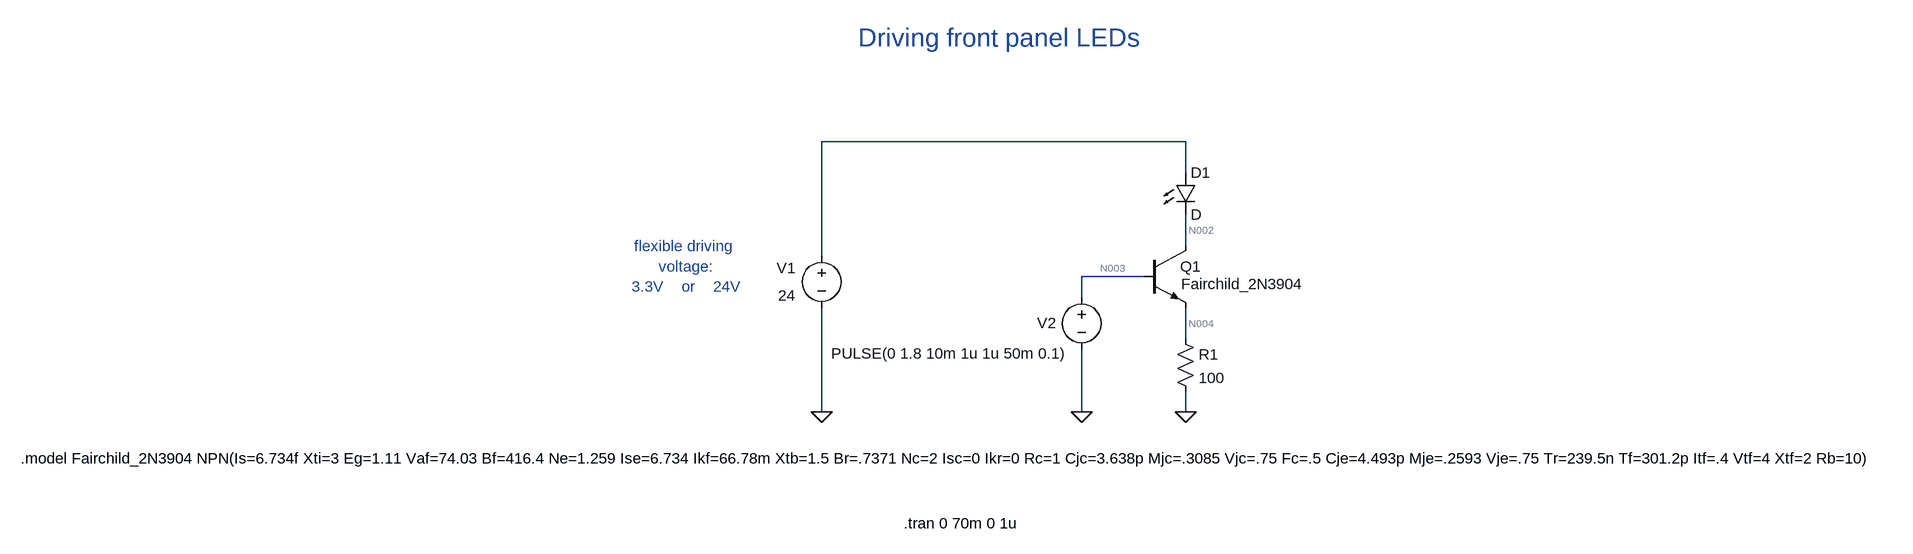
[diagram p0: schematic UZ_CB_LEDdrive.asc]
UZ_CB_LEDdrive.asc, the LTspice schematic file:
Version 4
SHEET 1 3568 680
WIRE 448 0 -112 0
WIRE 448 48 448 0
WIRE 448 160 448 112
WIRE -112 176 -112 0
WIRE 384 208 288 208
WIRE 288 240 288 208
WIRE 448 304 448 256
WIRE -112 416 -112 256
WIRE 288 416 288 320
WIRE 448 416 448 384
FLAG -112 416 0
FLAG 448 416 0
FLAG 288 416 0
SYMBOL voltage -112 160 R0
WINDOW 0 -69 35 Left 2
WINDOW 3 -67 77 Left 2
WINDOW 123 0 0 Left 2
WINDOW 39 0 0 Left 2
SYMATTR InstName V1
SYMATTR Value 24
SYMBOL res 432 288 R0
SYMATTR InstName R1
SYMATTR Value 100
SYMBOL LED 432 48 R0
SYMATTR InstName D1
SYMBOL voltage 288 224 R0
WINDOW 0 -68 55 Left 2
WINDOW 3 -385 102 Left 2
WINDOW 123 0 0 Left 2
WINDOW 39 0 0 Left 2
SYMATTR InstName V2
SYMATTR Value PULSE(0 1.8 10m 1u 1u 50m 0.1)
SYMBOL npn 384 160 R0
WINDOW 3 57 59 Left 2
SYMATTR InstName Q1
SYMATTR Value Fairchild_2N3904
TEXT -1344 488 Left 2 !.model Fairchild_2N3904 NPN(Is=6.734f Xti=3 Eg=1.11 Vaf=74.03 Bf=416.4 Ne=1.259 Ise=6.734 Ikf=66.78m Xtb=1.5 Br=.7371 Nc=2 Isc=0 Ikr=0 Rc=1 Cjc=3.638p Mjc=.3085 Vjc=.75 Fc=.5 Cje=4.493p Mje=.2593 Vje=.75 Tr=239.5n Tf=301.2p Itf=.4 Vtf=4 Xtf=2 Rb=10)
TEXT 14 588 Left 2 !.tran 0 70m 0 1u
TEXT -56 -160 Left 4 ;Driving front panel LEDs
TEXT -320 192 Center 2 ;flexible driving \nvoltage:\n3.3V    or    24V

The netlist it stands for:
* UZ_CB_LEDdrive.asc
V1 N001 0 24
R1 N004 0 100
D1 N001 N002 D
V2 N003 0 PULSE(0 1.8 10m 1u 1u 50m 0.1)
Q1 N002 N003 N004 0 Fairchild_2N3904
.model D D
.lib standard.dio
.model NPN NPN
.model PNP PNP
.lib standard.bjt
.model Fairchild_2N3904 NPN(Is=6.734f Xti=3 Eg=1.11 Vaf=74.03 Bf=416.4 Ne=1.259 Ise=6.734 Ikf=66.78m Xtb=1.5 Br=.7371 Nc=2 Isc=0 Ikr=0 Rc=1 Cjc=3.638p Mjc=.3085 Vjc=.75 Fc=.5 Cje=4.493p Mje=.2593 Vje=.75 Tr=239.5n Tf=301.2p Itf=.4 Vtf=4 Xtf=2 Rb=10)
.tran 0 70m 0 1u
* Driving front panel LEDs
* flexible driving
* voltage:
* 3.3V    or    24V
.backanno
.end

* Results of the author's LTspice run, read from the files saved beside the schematic
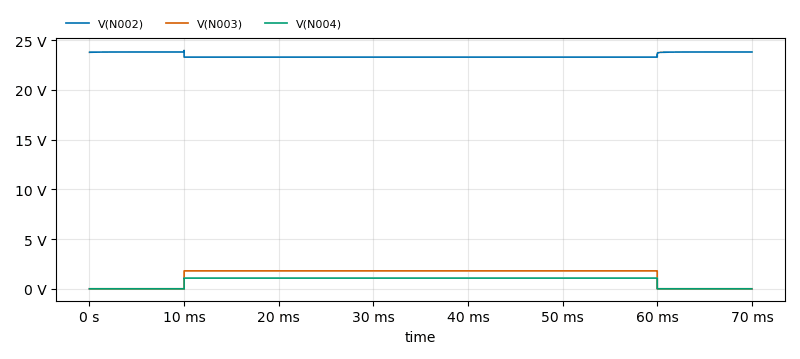
[diagram p1: Transient Analysis of UZ_CB_LEDdrive.asc, plotted from the saved traces]
* Transient Analysis, 1 run:
*   V(N002): min 23.28 V, max 23.96 V, average 23.43 V, rms 23.43 V, last 23.8 V
*   V(N003): min 0 V, max 1.8 V, average 1.286 V, rms 1.521 V, last 0 V
*   V(N004): min -881 µV, max 1.075 V, average 768 mV, rms 908.7 mV, last 0 V